# EAGLE design beeshield (EAGLE 6.4)
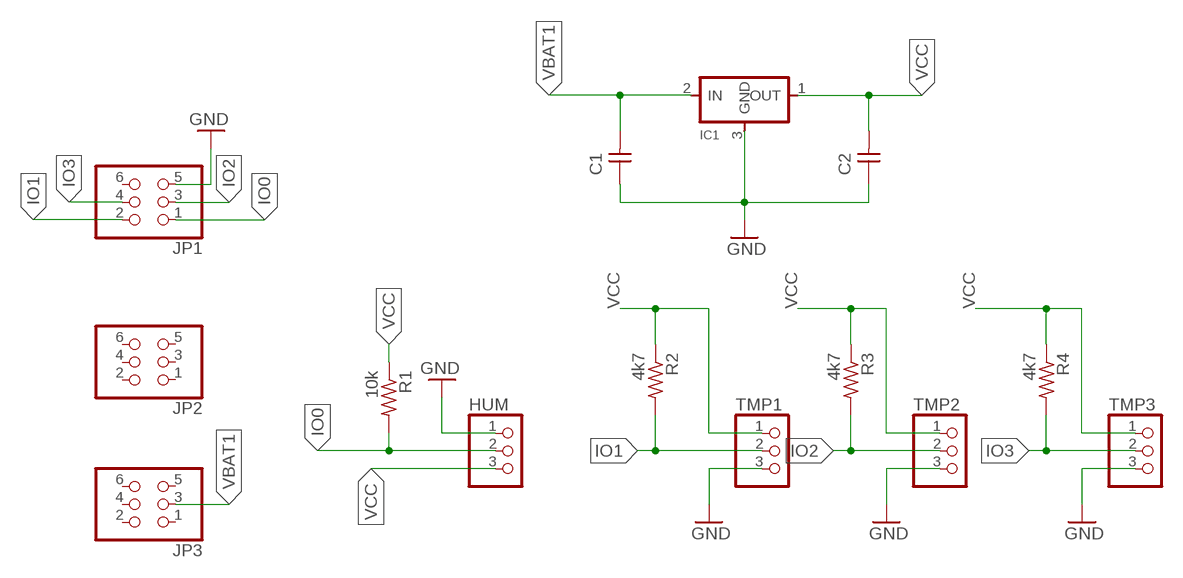
[diagram p0: schematic, sheet 1]

## Parts
C1  UNPOLARIZED_CAPACITOR1206  [1206]
C2  UNPOLARIZED_CAPACITOR1206  [1206]
HUM  PINHD-1X3  [1X03]
IC1  REGULATORSOT23  [SOT23]
JP1  PINHD-2X3-SMD  [2X03SMD]
JP2  PINHD-2X3-SMD  [2X03SMD]
JP3  PINHD-2X3-SMD  [2X03SMD]
R1  10k  RESISTOR1206  [1206]
R2  4k7  RESISTOR1206  [1206]
R3  4k7  RESISTOR1206  [1206]
R4  4k7  RESISTOR1206  [1206]
TMP1  PINHD-1X3  [1X03]
TMP2  PINHD-1X3  [1X03]
TMP3  PINHD-1X3  [1X03]

## Nets
GND: C1.1 C2.1 HUM.1 IC1.3(GND) JP1.5 TMP1.3 TMP2.3 TMP3.3
IO0: HUM.2 JP1.1 R1.2
IO1: JP1.2 R2.2 TMP1.2
IO2: JP1.3 R3.2 TMP2.2
IO3: JP1.4 R4.2 TMP3.2
VBAT1: C1.2 IC1.2(IN) JP3.3
VCC: C2.2 HUM.3 IC1.1(OUT) R1.1 R2.1 R3.1 R4.1 TMP1.1 TMP2.1 TMP3.1
Unconnected: JP1.6 JP2.1 JP2.2 JP2.3 JP2.4 JP2.5 JP2.6 JP3.1 JP3.2 JP3.4 JP3.5 JP3.6

## Library data of the parts
C1 C2 = FAB_Hello:UNPOLARIZED_CAPACITOR: unpolarized_capacitor
HUM TMP1-TMP3 = pinhead:PINHD-1X3: PIN HEADER
IC1 = fab:REGULATOR
JP1-JP3 = fab:PINHD-2X3-SMD: PIN HEADER
R1-R4 = FAB_Hello:RESISTOR

## Board
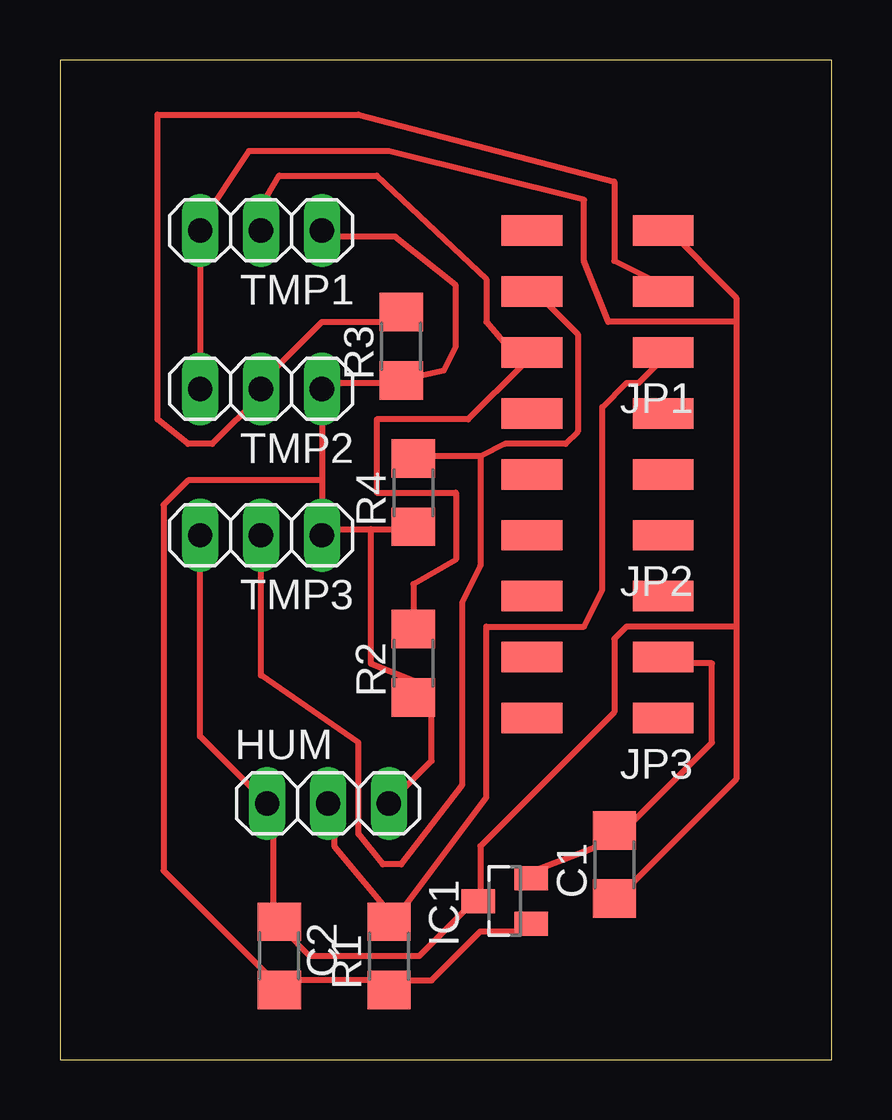
[diagram p1: board, top side]

Size 32.18 x 41.65 mm. Coordinates in mm from the lower left corner, seen from the top.
Outline: 0,0 32.18,0 32.18,41.65 0,41.65 0,0
Copper layers (1*16): Top 0.035mm / dielectric 1.5mm / Bottom 0.035mm
Design rules "default *": minimum track width 10mil, minimum drill 24mil, track to track 20mil, track to pad 8mil, pad to pad 8mil, via to via 8mil, smd to smd 8mil, copper to edge 40mil, drill to drill 8mil, minimum pad ring 10mil, minimum via ring 8mil, stop-mask expansion 4mil, vias tented up to drill 0mil, thermal gap 10mil

### Footprints (pad centres in the part's own frame; a part is rotated, then mirrored left to right if it is on the bottom)
1206 = smd 1.6 x 1.803: 1 -1.422,0; 2 1.422,0
1X03 = drill 1.016 long: 1 -2.54,0; 2 0,0; 3 2.54,0
SOT23 = smd 1 x 1.4: 1 -0.95,-1.1; 2 0.95,-1.1; 3 0,1.1
2X03SMD = smd 2.54 x 1.27: 1 -2.54,2.54; 2 2.92,2.54; 3 -2.54,0; 4 2.92,0; 5 -2.54,-2.54; 6 2.92,-2.54

### Placement (x,y rotation side)
C1  23.11,8.13 90 top
C2  9.14,4.32 270 top
HUM  11.18,10.67 0 top
IC1  18.54,6.6 90 top
JP1  22.61,32 180 top
JP2  22.61,24.38 180 top
JP3  22.61,16.76 180 top
R1  13.72,4.32 90 top
R2  14.73,16.51 90 top
R3  14.22,29.72 90 top
R4  14.73,23.62 90 top
TMP1  8.38,34.54 180 top
TMP2  8.38,27.94 180 top
TMP3  8.38,21.84 180 top

### Tracks (layer width: path | path; a pad name or v marks a point on that pad's centre or on a via)
GND
  Top 0.254: TMP3.3 5.84,13.46 HUM.1 8.89,10.41 8.89,5.84 C2.1 9.4,5.33 10.41,4.32 14.99,4.32 17.02,6.35 IC1.3 17.53,6.86 17.53,8.89 23.11,14.48 23.11,17.53 23.62,18.03 28.19,18.03 | TMP2.3 TMP1.3 5.84,34.8 7.87,37.85 13.72,37.85 21.84,35.81 21.84,33.27 22.86,30.73 28.19,30.73 | 28.19,30.73 28.19,31.75 25.15,34.8 JP1.5 | 28.19,30.73 28.19,18.03 | 28.19,18.03 28.19,11.68 23.11,6.6 C1.1
IO0
  Top 0.254: 13.97,5.84 13.46,5.84 R1.2 13.97,5.84 | 13.97,5.84 11.43,8.89 11.43,10.41 HUM.2 | 13.97,5.84 17.78,10.92 17.78,18.03 21.84,18.03 22.61,19.56 22.61,27.18 23.62,28.19 24.13,28.19 25.15,29.21 JP1.1
IO1
  Top 0.254: 19.3,28.96 19.56,29.21 JP1.2 | 19.3,28.96 17.02,26.67 13.21,26.67 13.21,23.62 16.51,23.62 16.51,20.83 14.73,19.81 R2.2 14.73,17.78 | TMP1.2 8.38,35.56 9.14,36.83 13.21,36.83 17.78,32.51 17.78,30.73 19.3,28.96
IO2
  Top 0.254: R3.2 14.22,30.73 10.92,30.73 8.38,28.19 TMP2.2 8.38,27.69 6.35,25.65 5.33,25.65 4.06,26.67 4.06,39.37 12.45,39.37 23.11,36.58 23.11,33.27 25.15,32.26 JP1.3
IO3
  Top 0.254: 17.53,25.15 14.73,25.15 R4.2 | 17.53,25.15 18.54,25.65 21.08,25.65 21.59,26.16 21.59,30.23 20.07,31.75 JP1.4 | TMP3.2 8.38,16 12.45,13.21 12.45,9.4 13.46,8.13 14.22,8.13 16.76,11.43 16.76,19.05 17.53,20.57 17.53,25.15
VBAT1
  Top 0.254: 23.11,9.14 19.81,7.87 20.07,7.87 IC1.2 | 23.11,9.14 27.18,13.21 27.18,16.51 25.15,16.51 JP3.3 | 23.11,9.14 C1.2
VCC
  Top 0.254: IC1.1 19.56,5.33 17.53,5.33 15.49,3.3 13.97,3.3 R1.1 13.46,3.3 9.4,3.3 C2.2 8.89,3.3 4.32,7.87 4.32,23.11 5.33,24.13 10.92,24.13 | HUM.3 15.49,12.45 15.49,14.99 R2.1 15.49,15.49 12.95,16.51 12.95,22.1 | 10.92,22.1 12.95,22.1 | 12.95,22.1 15.49,22.1 R4.1 | TMP1.1 10.92,34.29 13.97,34.29 16.51,32.26 16.51,29.72 16,28.7 R3.1 14.22,28.19 10.92,28.19 TMP2.1 10.92,24.13 | 10.92,24.13 10.92,22.1 | 10.92,22.1 TMP3.1